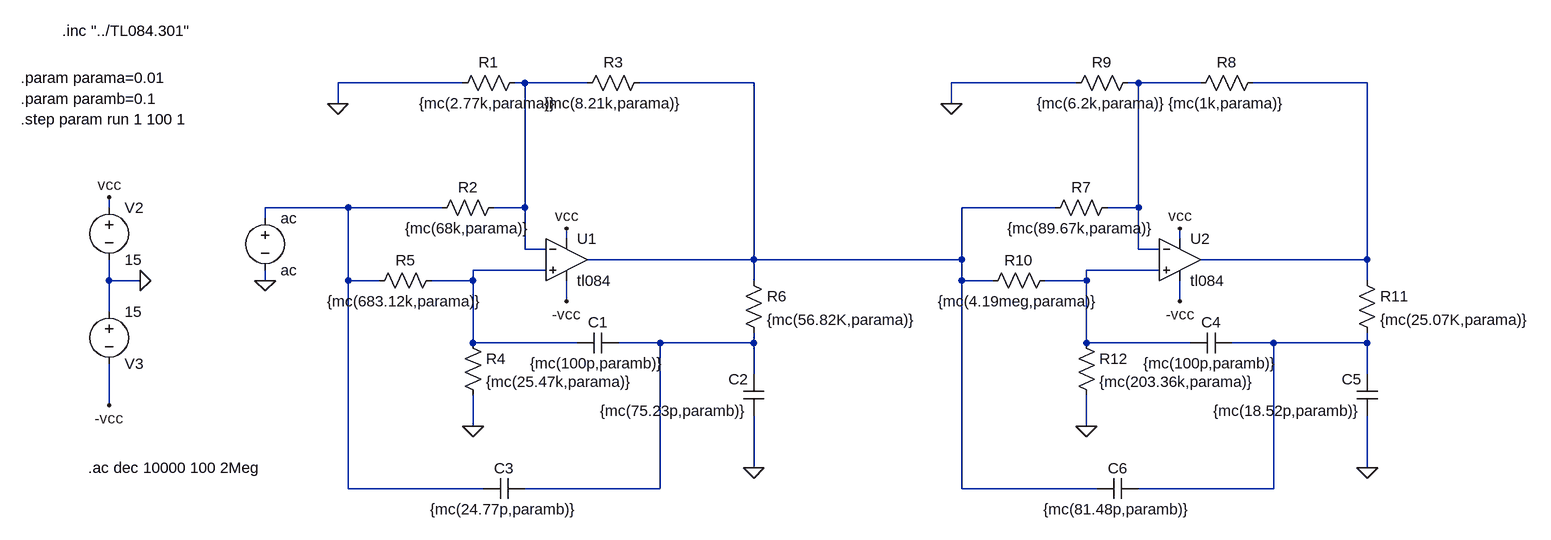
[diagram p0: schematic OsciladorMonteCarlo.asc]
OsciladorMonteCarlo.asc, the LTspice schematic file:
Version 4
SHEET 1 2020 680
WIRE 368 -160 176 -160
WIRE 464 -160 448 -160
WIRE 560 -160 464 -160
WIRE 816 -160 640 -160
WIRE 1312 -160 1120 -160
WIRE 1408 -160 1392 -160
WIRE 1504 -160 1408 -160
WIRE 1760 -160 1584 -160
WIRE 176 -128 176 -160
WIRE 1120 -128 1120 -160
WIRE -176 32 -176 16
WIRE 192 32 64 32
WIRE 336 32 192 32
WIRE 464 32 464 -160
WIRE 464 32 416 32
WIRE 1280 32 1136 32
WIRE 1408 32 1408 -160
WIRE 1408 32 1360 32
WIRE 64 48 64 32
WIRE 528 80 528 64
WIRE 1472 80 1472 64
WIRE 464 96 464 32
WIRE 496 96 464 96
WIRE 1408 96 1408 32
WIRE 1440 96 1408 96
WIRE 816 112 816 -160
WIRE 816 112 560 112
WIRE 1136 112 1136 32
WIRE 1136 112 816 112
WIRE 1760 112 1760 -160
WIRE 1760 112 1504 112
WIRE 496 128 384 128
WIRE 1440 128 1328 128
WIRE -176 144 -176 112
WIRE -128 144 -176 144
WIRE 64 144 64 128
WIRE 192 144 192 32
WIRE 240 144 192 144
WIRE 384 144 384 128
WIRE 384 144 320 144
WIRE 816 144 816 112
WIRE 1136 144 1136 112
WIRE 1184 144 1136 144
WIRE 1328 144 1328 128
WIRE 1328 144 1264 144
WIRE 1760 144 1760 112
WIRE 528 176 528 144
WIRE 1472 176 1472 144
WIRE -176 192 -176 144
WIRE 384 240 384 144
WIRE 544 240 384 240
WIRE 672 240 608 240
WIRE 816 240 816 224
WIRE 816 240 672 240
WIRE 1328 240 1328 144
WIRE 1488 240 1328 240
WIRE 1616 240 1552 240
WIRE 1760 240 1760 224
WIRE 1760 240 1616 240
WIRE 816 288 816 240
WIRE 1760 288 1760 240
WIRE -176 336 -176 272
WIRE 384 368 384 320
WIRE 1328 368 1328 320
WIRE 816 432 816 352
WIRE 1760 432 1760 352
WIRE 192 464 192 144
WIRE 400 464 192 464
WIRE 672 464 672 240
WIRE 672 464 464 464
WIRE 1136 464 1136 144
WIRE 1344 464 1136 464
WIRE 1616 464 1616 240
WIRE 1616 464 1408 464
FLAG -128 144 0
FLAG -176 16 vcc
FLAG -176 336 -vcc
FLAG 528 64 vcc
FLAG 528 176 -vcc
FLAG 384 368 0
FLAG 176 -128 0
FLAG 816 432 0
FLAG 64 144 0
FLAG 1472 64 vcc
FLAG 1472 176 -vcc
FLAG 1328 368 0
FLAG 1120 -128 0
FLAG 1760 432 0
SYMBOL Opamps\\opamp2 528 48 R0
SYMATTR InstName U1
SYMATTR Value tl084
SYMBOL voltage -176 16 R0
WINDOW 123 0 0 Left 0
WINDOW 39 0 0 Left 0
SYMATTR InstName V2
SYMATTR Value 15
SYMBOL voltage -176 176 R0
WINDOW 0 24 96 Left 2
WINDOW 3 24 16 Left 2
WINDOW 123 0 0 Left 0
WINDOW 39 0 0 Left 0
SYMATTR InstName V3
SYMATTR Value 15
SYMBOL res 432 16 R90
WINDOW 0 0 56 VBottom 2
WINDOW 3 32 56 VTop 2
SYMATTR InstName R2
SYMATTR Value {mc(68k,parama)}
SYMBOL res 656 -176 R90
WINDOW 0 0 56 VBottom 2
WINDOW 3 32 56 VTop 2
SYMATTR InstName R3
SYMATTR Value {mc(8.21k,parama)}
SYMBOL res 464 -176 R90
WINDOW 0 0 56 VBottom 2
WINDOW 3 32 56 VTop 2
SYMATTR InstName R1
SYMATTR Value {mc(2.77k,parama)}
SYMBOL res 336 128 R90
WINDOW 0 0 56 VBottom 2
WINDOW 3 32 56 VTop 2
SYMATTR InstName R5
SYMATTR Value {mc(683.12k,parama)}
SYMBOL res 800 128 R0
SYMATTR InstName R6
SYMATTR Value {mc(56.82K,parama)}
SYMBOL res 368 224 R0
SYMATTR InstName R4
SYMATTR Value {mc(25.47k,parama)}
SYMBOL cap 608 224 R90
WINDOW 0 0 32 VBottom 2
WINDOW 3 32 32 VTop 2
SYMATTR InstName C1
SYMATTR Value {mc(100p,paramb)}
SYMBOL cap 832 352 R180
WINDOW 0 24 56 Left 2
WINDOW 3 24 8 Left 2
SYMATTR InstName C2
SYMATTR Value {mc(75.23p,paramb)}
SYMBOL cap 400 480 R270
WINDOW 0 32 32 VTop 2
WINDOW 3 0 32 VBottom 2
SYMATTR InstName C3
SYMATTR Value {mc(24.77p,paramb)}
SYMBOL voltage 64 32 R0
WINDOW 123 0 0 Left 0
WINDOW 39 0 0 Left 0
SYMATTR InstName ac
SYMATTR Value ac
SYMBOL Opamps\\opamp2 1472 48 R0
SYMATTR InstName U2
SYMATTR Value tl084
SYMBOL res 1376 16 R90
WINDOW 0 0 56 VBottom 2
WINDOW 3 32 56 VTop 2
SYMATTR InstName R7
SYMATTR Value {mc(89.67k,parama)}
SYMBOL res 1600 -176 R90
WINDOW 0 0 56 VBottom 2
WINDOW 3 32 56 VTop 2
SYMATTR InstName R8
SYMATTR Value {mc(1k,parama)}
SYMBOL res 1408 -176 R90
WINDOW 0 0 56 VBottom 2
WINDOW 3 32 56 VTop 2
SYMATTR InstName R9
SYMATTR Value {mc(6.2k,parama)}
SYMBOL res 1280 128 R90
WINDOW 0 0 56 VBottom 2
WINDOW 3 32 56 VTop 2
SYMATTR InstName R10
SYMATTR Value {mc(4.19meg,parama)}
SYMBOL res 1744 128 R0
SYMATTR InstName R11
SYMATTR Value {mc(25.07K,parama)}
SYMBOL res 1312 224 R0
SYMATTR InstName R12
SYMATTR Value {mc(203.36k,parama)}
SYMBOL cap 1552 224 R90
WINDOW 0 0 32 VBottom 2
WINDOW 3 32 32 VTop 2
SYMATTR InstName C4
SYMATTR Value {mc(100p,paramb)}
SYMBOL cap 1776 352 R180
WINDOW 0 24 56 Left 2
WINDOW 3 24 8 Left 2
SYMATTR InstName C5
SYMATTR Value {mc(18.52p,paramb)}
SYMBOL cap 1344 480 R270
WINDOW 0 32 32 VTop 2
WINDOW 3 0 32 VBottom 2
SYMATTR InstName C6
SYMATTR Value {mc(81.48p,paramb)}
TEXT -208 432 Left 2 !.ac dec 10000 100 2Meg
TEXT -312 -168 Left 2 !.param parama=0.01
TEXT -312 -136 Left 2 !.param paramb=0.1
TEXT -312 -104 Left 2 !.step param run 1 100 1
TEXT -248 -240 Left 2 !.inc "../TL084.301"

The netlist it stands for:
* OsciladorMonteCarlo.asc
XU1 N006 N001 vcc -vcc N002 tl084  ; pins In+ In- V+ V- OUT
V2 vcc 0 15
V3 0 -vcc 15
R2 N001 N005 {mc(68k,parama)}
R3 N002 N001 {mc(8.21k,parama)}
R1 N001 0 {mc(2.77k,parama)}
R5 N006 N005 {mc(683.12k,parama)}
R6 N002 N008 {mc(56.82K,parama)}
R4 N006 0 {mc(25.47k,parama)}
C1 N008 N006 {mc(100p,paramb)}
C2 0 N008 {mc(75.23p,paramb)}
C3 N005 N008 {mc(24.77p,paramb)}
V§ac N005 0 ac
XU2 N007 N003 vcc -vcc N004 tl084  ; pins In+ In- V+ V- OUT
R7 N003 N002 {mc(89.67k,parama)}
R8 N004 N003 {mc(1k,parama)}
R9 N003 0 {mc(6.2k,parama)}
R10 N007 N002 {mc(4.19meg,parama)}
R11 N004 N009 {mc(25.07K,parama)}
R12 N007 0 {mc(203.36k,parama)}
C4 N009 N007 {mc(100p,paramb)}
C5 0 N009 {mc(18.52p,paramb)}
C6 N002 N009 {mc(81.48p,paramb)}
.ac dec 10000 100 2Meg
.param parama=0.01
.param paramb=0.1
.step param run 1 100 1
.inc "../TL084.301"
.backanno
.end